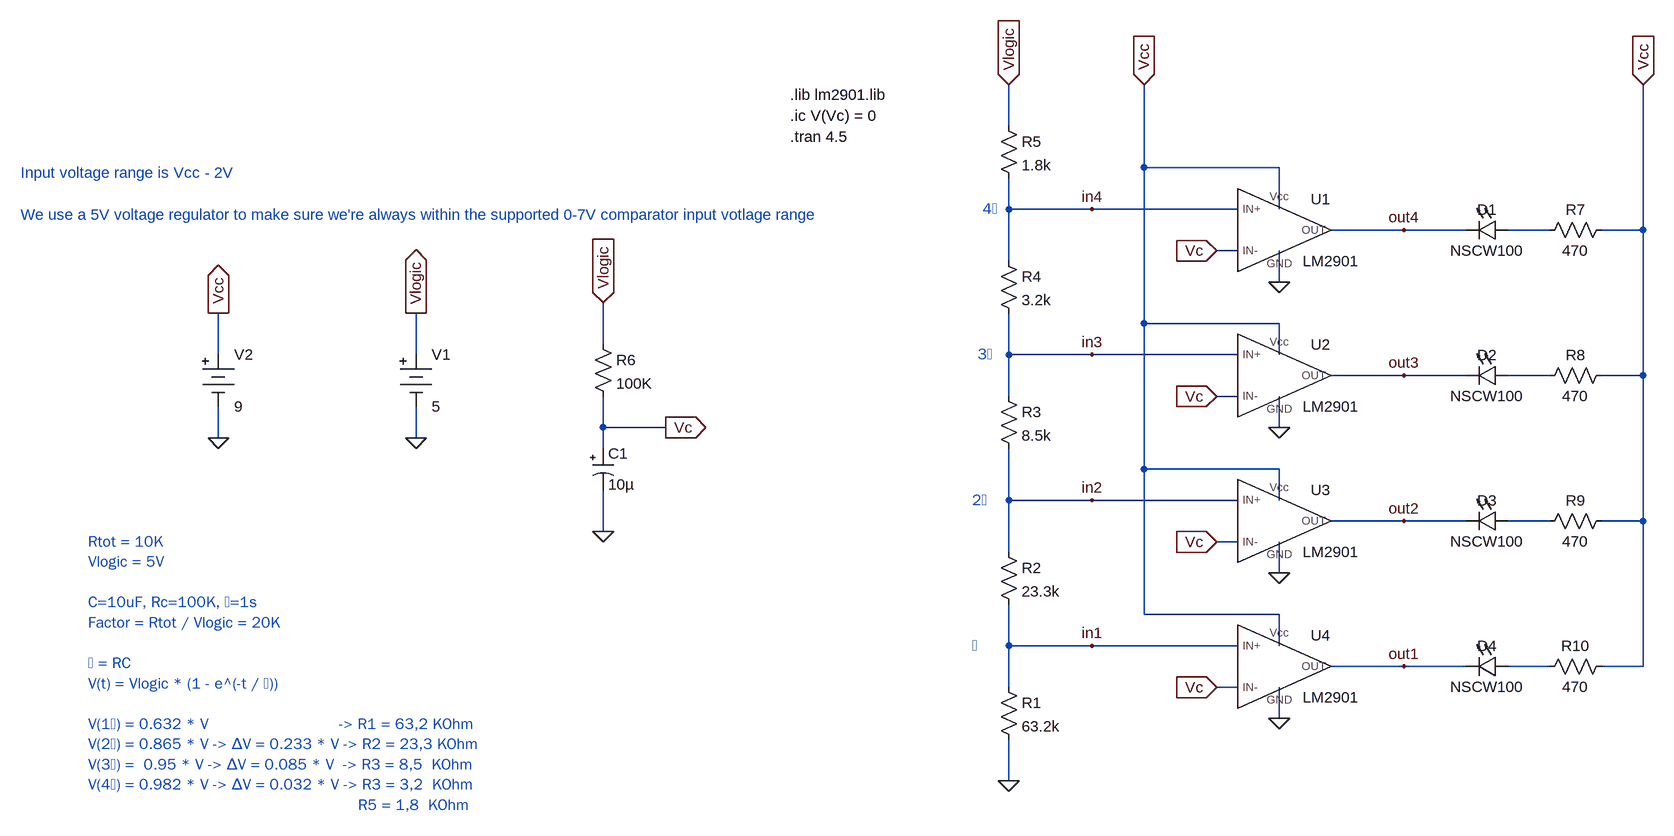
[diagram p0: schematic capacitor-timer.asc]
capacitor-timer.asc, the LTspice schematic file:
Version 4
SHEET 1 2128 680
WIRE 912 -960 912 -1024
WIRE 1120 -896 1120 -1024
WIRE 1328 -896 1120 -896
WIRE 912 -832 912 -880
WIRE 1040 -832 912 -832
WIRE 1264 -832 1040 -832
WIRE 1328 -832 1328 -896
WIRE 1520 -800 1408 -800
WIRE 1616 -800 1520 -800
WIRE 1744 -800 1680 -800
WIRE 1888 -800 1888 -1024
WIRE 1888 -800 1824 -800
WIRE 1264 -768 1232 -768
WIRE 912 -752 912 -832
WIRE 1328 -720 1328 -768
WIRE 1120 -656 1120 -896
WIRE 1328 -656 1120 -656
WIRE 288 -624 288 -688
WIRE -304 -608 -304 -672
WIRE 0 -608 0 -672
WIRE 912 -608 912 -672
WIRE 1040 -608 912 -608
WIRE 1264 -608 1040 -608
WIRE 1328 -608 1328 -656
WIRE 1520 -576 1408 -576
WIRE 1616 -576 1520 -576
WIRE 1744 -576 1680 -576
WIRE 1888 -576 1888 -800
WIRE 1888 -576 1824 -576
WIRE 912 -544 912 -608
WIRE 1264 -544 1232 -544
WIRE 288 -496 288 -544
WIRE 384 -496 288 -496
WIRE 1328 -496 1328 -544
WIRE -304 -480 -304 -528
WIRE 0 -480 0 -528
WIRE 288 -464 288 -496
WIRE 1120 -432 1120 -656
WIRE 1328 -432 1120 -432
WIRE 912 -384 912 -464
WIRE 1040 -384 912 -384
WIRE 1264 -384 1040 -384
WIRE 1328 -384 1328 -432
WIRE 1520 -352 1408 -352
WIRE 1616 -352 1520 -352
WIRE 1744 -352 1680 -352
WIRE 1888 -352 1888 -576
WIRE 1888 -352 1824 -352
WIRE 288 -336 288 -400
WIRE 1264 -320 1232 -320
WIRE 912 -304 912 -384
WIRE 1328 -272 1328 -320
WIRE 1120 -208 1120 -432
WIRE 1328 -208 1120 -208
WIRE 912 -160 912 -224
WIRE 1040 -160 912 -160
WIRE 1264 -160 1040 -160
WIRE 1328 -160 1328 -208
WIRE 1520 -128 1408 -128
WIRE 1616 -128 1520 -128
WIRE 1744 -128 1680 -128
WIRE 1888 -128 1888 -352
WIRE 1888 -128 1824 -128
WIRE 912 -96 912 -160
WIRE 1264 -96 1232 -96
WIRE 1328 -48 1328 -96
WIRE 912 48 912 -16
FLAG 0 -480 0
FLAG 0 -672 Vlogic
IOPIN 0 -672 Out
FLAG 912 -1024 Vlogic
IOPIN 912 -1024 In
FLAG 912 48 0
FLAG 288 -688 Vlogic
IOPIN 288 -688 In
FLAG 288 -336 0
FLAG 1888 -1024 Vcc
IOPIN 1888 -1024 In
FLAG 384 -496 Vc
IOPIN 384 -496 Out
FLAG 1328 -720 0
FLAG 1328 -496 0
FLAG 1328 -272 0
FLAG 1328 -48 0
FLAG 1232 -768 Vc
IOPIN 1232 -768 In
FLAG 1232 -544 Vc
IOPIN 1232 -544 In
FLAG 1232 -320 Vc
IOPIN 1232 -320 In
FLAG 1232 -96 Vc
IOPIN 1232 -96 In
FLAG 1120 -1024 Vcc
IOPIN 1120 -1024 In
FLAG 1520 -128 out1
FLAG 1520 -352 out2
FLAG 1520 -576 out3
FLAG 1520 -800 out4
FLAG -304 -480 0
FLAG -304 -672 Vcc
IOPIN -304 -672 Out
FLAG 1040 -160 in1
FLAG 1040 -384 in2
FLAG 1040 -608 in3
FLAG 1040 -832 in4
SYMBOL Misc\\battery 0 -624 R0
WINDOW 123 0 0 Left 0
WINDOW 39 0 0 Left 0
SYMATTR InstName V1
SYMATTR Value 5
SYMBOL res 896 -976 R0
SYMATTR InstName R5
SYMATTR Value 1.8k
SYMBOL res 896 -768 R0
SYMATTR InstName R4
SYMATTR Value 3.2k
SYMBOL res 896 -560 R0
SYMATTR InstName R3
SYMATTR Value 8.5k
SYMBOL res 896 -320 R0
SYMATTR InstName R2
SYMATTR Value 23.3k
SYMBOL res 896 -112 R0
SYMATTR InstName R1
SYMATTR Value 63.2k
SYMBOL res 272 -640 R0
SYMATTR InstName R6
SYMATTR Value 100K
SYMBOL polcap 272 -464 R0
WINDOW 3 24 56 Left 2
SYMATTR Value 10µ
SYMATTR InstName C1
SYMATTR Description Capacitor
SYMATTR Type cap
SYMATTR SpiceLine V=16 Irms=17m Rser=2.2912 Lser=1.063n mfg="W�rth Elektronik" pn="865230340001 WCAP-AS5H 4x5,5" type="Al electrolytic"
SYMBOL LED 1680 -816 R90
WINDOW 0 0 32 VBottom 2
WINDOW 3 32 32 VTop 2
SYMATTR InstName D1
SYMATTR Value NSCW100
SYMATTR Description Diode
SYMATTR Type diode
SYMBOL res 1840 -816 R90
WINDOW 0 0 56 VBottom 2
WINDOW 3 32 56 VTop 2
SYMATTR InstName R7
SYMATTR Value 470
SYMBOL LED 1680 -592 R90
WINDOW 0 0 32 VBottom 2
WINDOW 3 32 32 VTop 2
SYMATTR InstName D2
SYMATTR Value NSCW100
SYMATTR Description Diode
SYMATTR Type diode
SYMBOL res 1840 -592 R90
WINDOW 0 0 56 VBottom 2
WINDOW 3 32 56 VTop 2
SYMATTR InstName R8
SYMATTR Value 470
SYMBOL LED 1680 -368 R90
WINDOW 0 0 32 VBottom 2
WINDOW 3 32 32 VTop 2
SYMATTR InstName D3
SYMATTR Value NSCW100
SYMATTR Description Diode
SYMATTR Type diode
SYMBOL res 1840 -368 R90
WINDOW 0 0 56 VBottom 2
WINDOW 3 32 56 VTop 2
SYMATTR InstName R9
SYMATTR Value 470
SYMBOL LED 1680 -144 R90
WINDOW 0 0 32 VBottom 2
WINDOW 3 32 32 VTop 2
SYMATTR InstName D4
SYMATTR Value NSCW100
SYMATTR Description Diode
SYMATTR Type diode
SYMBOL res 1840 -144 R90
WINDOW 0 0 56 VBottom 2
WINDOW 3 32 56 VTop 2
SYMATTR InstName R10
SYMATTR Value 470
SYMBOL AutoGenerated\\LM2901 1328 -816 R0
SYMATTR InstName U1
SYMBOL AutoGenerated\\LM2901 1328 -592 R0
SYMATTR InstName U2
SYMBOL AutoGenerated\\LM2901 1328 -368 R0
SYMATTR InstName U3
SYMBOL AutoGenerated\\LM2901 1328 -144 R0
SYMATTR InstName U4
SYMBOL Misc\\battery -304 -624 R0
WINDOW 123 0 0 Left 0
WINDOW 39 0 0 Left 0
SYMATTR InstName V2
SYMATTR Value 9
TEXT 576 -944 Left 2 !.tran 4.5
TEXT 576 -976 Left 2 !.ic V(Vc) = 0
TEXT -608 -888 Left 2 ;Input voltage range is Vcc - 2V
TEXT -608 -824 Left 2 ;We use a 5V voltage regulator to make sure we're always within the supported 0-7V comparator input votlage range
TEXT -504 -320 Left 2 ;Rtot = 10K\nVlogic = 5V\n \nC=10uF, Rc=100K, 𝜏=1s\nFactor = Rtot / Vlogic = 20K\n \n𝜏 = RC\nV(t) = Vlogic * (1 - e^(-t / 𝜏))\n \nV(1𝜏) = 0.632 * V                             -> R1 = 63,2 KOhm\nV(2𝜏) = 0.865 * V -> ΔV = 0.233 * V -> R2 = 23,3 KOhm\nV(3𝜏) =  0.95 * V -> ΔV = 0.085 * V  -> R3 = 8,5  KOhm\nV(4𝜏) = 0.982 * V -> ΔV = 0.032 * V -> R3 = 3,2  KOhm\n                                                            R5 = 1,8  KOhm
TEXT 576 -1008 Left 2 !.lib lm2901.lib
TEXT 856 -160 Left 2 ;𝜏
TEXT 856 -384 Left 2 ;2𝜏
TEXT 864 -608 Left 2 ;3𝜏
TEXT 872 -832 Left 2 ;4𝜏

The netlist it stands for:
* capacitor-timer.asc
V1 Vlogic 0 5
R5 Vlogic in4 1.8k
R4 in4 in3 3.2k
R3 in3 in2 8.5k
R2 in2 in1 23.3k
R1 in1 0 63.2k
R6 Vlogic Vc 100K
C1 Vc 0 10µ V=16 Irms=17m Rser=2.2912 Lser=1.063n mfg="W�rth Elektronik" pn="865230340001 WCAP-AS5H 4x5,5" type="Al electrolytic"
D1 N001 out4 NSCW100
R7 Vcc N001 470
D2 N002 out3 NSCW100
R8 Vcc N002 470
D3 N003 out2 NSCW100
R9 Vcc N003 470
D4 N004 out1 NSCW100
R10 Vcc N004 470
XU1 in4 Vc Vcc 0 out4 LM2901  ; pins IN+ IN- Vcc GND OUT
XU2 in3 Vc Vcc 0 out3 LM2901  ; pins IN+ IN- Vcc GND OUT
XU3 in2 Vc Vcc 0 out2 LM2901  ; pins IN+ IN- Vcc GND OUT
XU4 in1 Vc Vcc 0 out1 LM2901  ; pins IN+ IN- Vcc GND OUT
V2 Vcc 0 9
.model D D
.lib standard.dio
.tran 4.5
.ic V(Vc) = 0
* Input voltage range is Vcc - 2V
* We use a 5V voltage regulator to make sure we're always within the supported 0-7V comparator input votlage range
* Rtot = 10K
* Vlogic = 5V
* C=10uF, Rc=100K, 𝜏=1s
* Factor = Rtot / Vlogic = 20K
* 𝜏 = RC
* V(t) = Vlogic * (1 - e^(-t / 𝜏))
* V(1𝜏) = 0.632 * V                             -> R1 = 63,2 KOhm
* V(2𝜏) = 0.865 * V -> ΔV = 0.233 * V -> R2 = 23,3 KOhm
* V(3𝜏) =  0.95 * V -> ΔV = 0.085 * V  -> R3 = 8,5  KOhm
* V(4𝜏) = 0.982 * V -> ΔV = 0.032 * V -> R3 = 3,2  KOhm
*                                                             R5 = 1,8  KOhm
.lib lm2901.lib
* 𝜏
* 2𝜏
* 3𝜏
* 4𝜏
.lib \\wsl.localhost\Ubuntu\home\llioha\coding\electronics-projects\capacitor-timer\lm2901.lib
.backanno
.end